# Altium schematic sheet 2SiPM_2.SchDoc
size A4
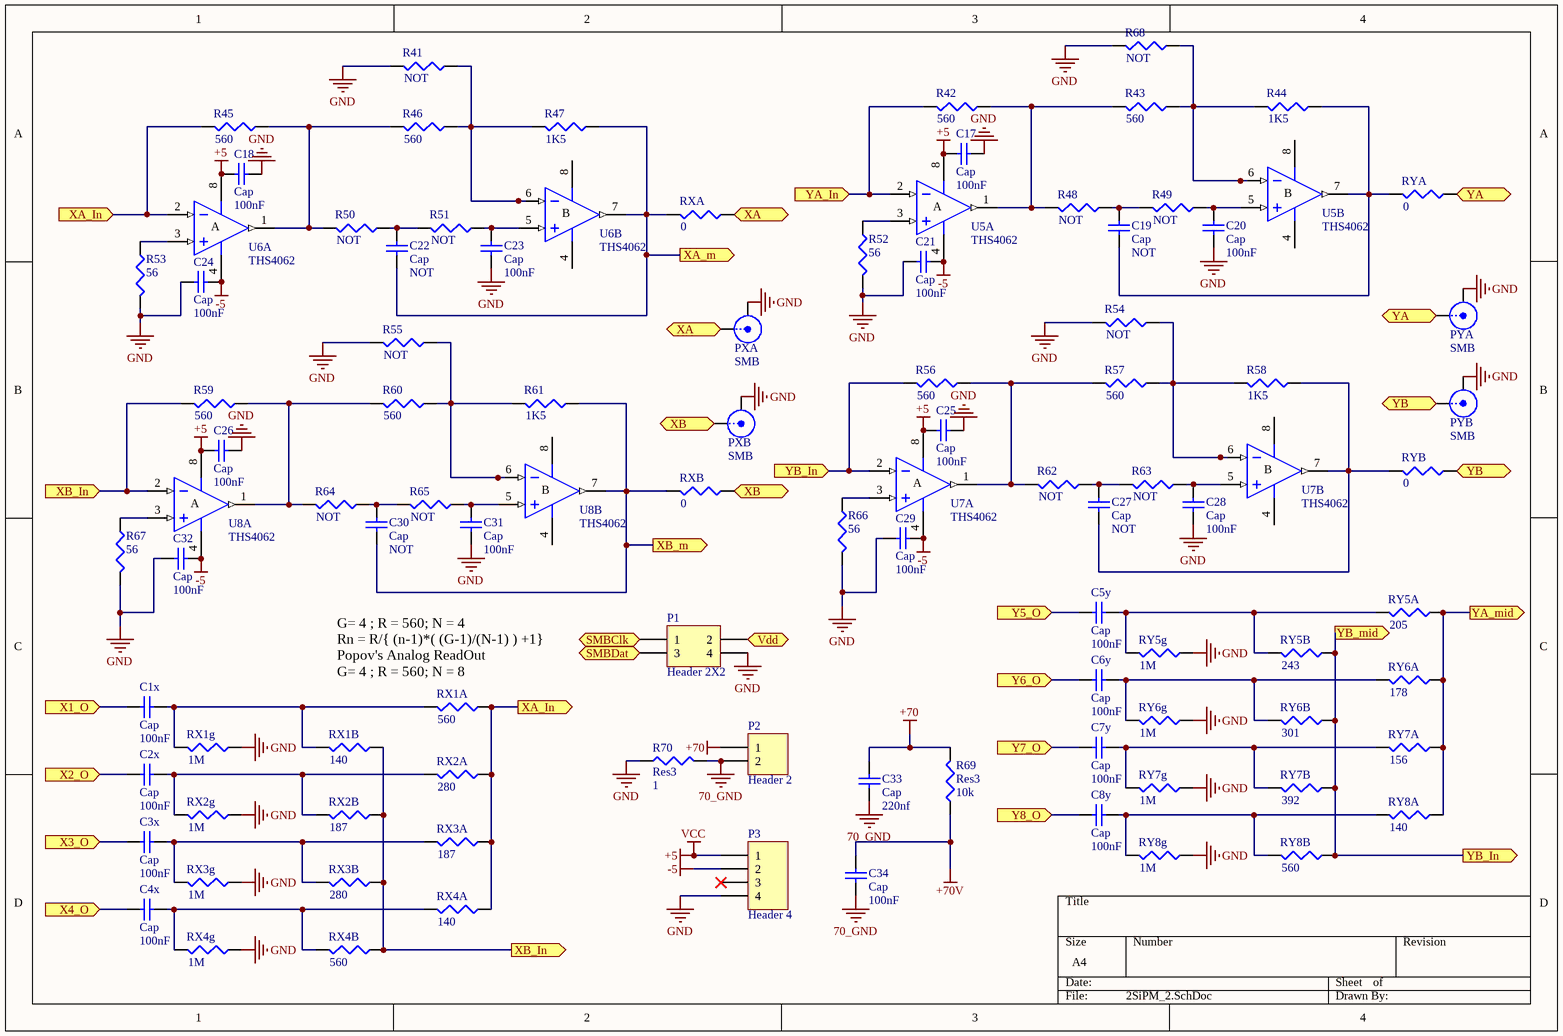
[diagram p0: 2SiPM_2.SchDoc]

## Parts
C1x  Cap  value 100nF  [1608[0603]]
C2x  Cap  value 100nF  [1608[0603]]
C3x  Cap  value 100nF  [1608[0603]]
C4x  Cap  value 100nF  [1608[0603]]
C5y  Cap  value 100nF  [1608[0603]]
C6y  Cap  value 100nF  [1608[0603]]
C7y  Cap  value 100nF  [1608[0603]]
C8y  Cap  value 100nF  [1608[0603]]
C17  Cap  value 100nF  [1608[0603]]
C18  Cap  value 100nF  [1608[0603]]
C19  Cap  value NOT  [1608[0603]]
C20  Cap  value 100nF  [1608[0603]]
C21  Cap  value 100nF  [1608[0603]]
C22  Cap  value NOT  [1608[0603]]
C23  Cap  value 100nF  [1608[0603]]
C24  Cap  value 100nF  [1608[0603]]
C25  Cap  value 100nF  [1608[0603]]
C26  Cap  value 100nF  [1608[0603]]
C27  Cap  value NOT  [1608[0603]]
C28  Cap  value 100nF  [1608[0603]]
C29  Cap  value 100nF  [1608[0603]]
C30  Cap  value NOT  [1608[0603]]
C31  Cap  value 100nF  [1608[0603]]
C32  Cap  value 100nF  [1608[0603]]
C33  Cap  value 220nf  [6-0805_N]
C34  Cap  value 100nF  [6-0805_N]
P1  Header 2X2  [HDR2X2]
P2  Header 2  [HDR1X2]
P3  Header 4  [HDR1X4]
PXA  SMB  [SMB_V-RJ45]
PXB  SMB  [SMB_V-RJ45]
PYA  SMB  [SMB_V-RJ45]
PYB  SMB  [SMB_V-RJ45]
R41  value NOT  [J1-0603]  (hidden comment: Res3)
R42  value 560  [J1-0603]  (hidden comment: Res3)
R43  value 560  [J1-0603]  (hidden comment: Res3)
R44  value 1K5  [J1-0603]  (hidden comment: Res3)
R45  value 560  [J1-0603]  (hidden comment: Res3)
R46  value 560  [J1-0603]  (hidden comment: Res3)
R47  value 1K5  [J1-0603]  (hidden comment: Res3)
R48  value NOT  [J1-0603]  (hidden comment: Res3)
R49  value NOT  [J1-0603]  (hidden comment: Res3)
R50  value NOT  [J1-0603]  (hidden comment: Res3)
R51  value NOT  [J1-0603]  (hidden comment: Res3)
R52  value 56  [J1-0603]  (hidden comment: Res3)
R53  value 56  [J1-0603]  (hidden comment: Res3)
R54  value NOT  [J1-0603]  (hidden comment: Res3)
R55  value NOT  [J1-0603]  (hidden comment: Res3)
R56  value 560  [J1-0603]  (hidden comment: Res3)
R57  value 560  [J1-0603]  (hidden comment: Res3)
R58  value 1K5  [J1-0603]  (hidden comment: Res3)
R59  value 560  [J1-0603]  (hidden comment: Res3)
R60  value 560  [J1-0603]  (hidden comment: Res3)
R61  value 1K5  [J1-0603]  (hidden comment: Res3)
R62  value NOT  [J1-0603]  (hidden comment: Res3)
R63  value NOT  [J1-0603]  (hidden comment: Res3)
R64  value NOT  [J1-0603]  (hidden comment: Res3)
R65  value NOT  [J1-0603]  (hidden comment: Res3)
R66  value 56  [J1-0603]  (hidden comment: Res3)
R67  value 56  [J1-0603]  (hidden comment: Res3)
R68  value NOT  [J1-0603]  (hidden comment: Res3)
R69  Res3  value 10k  [6-0805_N]
R70  Res3  value 1  [6-0805_N]
RX1A  value 560  [J1-0603]  (hidden comment: Res3)
RX1B  value 140  [J1-0603]  (hidden comment: Res3)
RX1g  value 1M  [J1-0603]  (hidden comment: Res3)
RX2A  value 280  [J1-0603]  (hidden comment: Res3)
RX2B  value 187  [J1-0603]  (hidden comment: Res3)
RX2g  value 1M  [J1-0603]  (hidden comment: Res3)
RX3A  value 187  [J1-0603]  (hidden comment: Res3)
RX3B  value 280  [J1-0603]  (hidden comment: Res3)
RX3g  value 1M  [J1-0603]  (hidden comment: Res3)
RX4A  value 140  [J1-0603]  (hidden comment: Res3)
RX4B  value 560  [J1-0603]  (hidden comment: Res3)
RX4g  value 1M  [J1-0603]  (hidden comment: Res3)
RXA  value 0  [J1-0603]  (hidden comment: Res3)
RXB  value 0  [J1-0603]  (hidden comment: Res3)
RY5A  value 205  [J1-0603]  (hidden comment: Res3)
RY5B  value 243  [J1-0603]  (hidden comment: Res3)
RY5g  value 1M  [J1-0603]  (hidden comment: Res3)
RY6A  value 178  [J1-0603]  (hidden comment: Res3)
RY6B  value 301  [J1-0603]  (hidden comment: Res3)
RY6g  value 1M  [J1-0603]  (hidden comment: Res3)
RY7A  value 156  [J1-0603]  (hidden comment: Res3)
RY7B  value 392  [J1-0603]  (hidden comment: Res3)
RY7g  value 1M  [J1-0603]  (hidden comment: Res3)
RY8A  value 140  [J1-0603]  (hidden comment: Res3)
RY8B  value 560  [J1-0603]  (hidden comment: Res3)
RY8g  value 1M  [J1-0603]  (hidden comment: Res3)
RYA  value 0  [J1-0603]  (hidden comment: Res3)
RYB  value 0  [J1-0603]  (hidden comment: Res3)
U5  THS4062  [SO8_M]  (parts A,B of 2)
U6  THS4062  [SO8_M]  (parts A,B of 2)
U7  THS4062  [SO8_M]  (parts A,B of 2)
U8  THS4062  [SO8_M]  (parts A,B of 2)

## Ports
SMBClk (out), SMBDat (out), Vdd (out), X1_O (in), X2_O (in), X3_O (in), X4_O (in), XA (out), XA_In (in), XA_In (out), XA_m (out), XB (out), XB_In (in), XB_In (out), XB_m (out), Y5_O (in), Y6_O (in), Y7_O (in), Y8_O (in), YA (out), YA_In (in), YA_mid (out), YB (out), YB_In (in), YB_In (out), YB_mid (out)

## Nets
70_GND: C33.1 C34.1 P2.2 R70.2
+5: C17.1 C18.1 C25.1 C26.1 P3.1 U5.8(V+) U6.8(V+) U7.8(V+) U8.8(V+)  [also labelled VCC]
+70: C33.2 P2.1 R69.2
+70V: C34.2 R69.1
-5: C21.2 C24.2 C29.2 C32.2 P3.2 U5.4(V-) U6.4(V-) U7.4(V-) U8.4(V-)
GND: C17.2 C18.2 C20.2 C21.1 C23.2 C24.1 C25.2 C26.2 C28.2 C29.1 C31.2 C32.1 P1.4 P3.4 PXA.2(Y) PXB.2(Y) PYA.2(Y) PYB.2(Y) R41.2 R52.2 R53.2 R54.2 R55.2 R66.2 R67.2 R68.2 R70.1 RX1g.1 RX2g.1 RX3g.1 RX4g.1 RY5g.1 RY6g.1 RY7g.1 RY8g.1
SMBClk: P1.1 ; port SMBClk
SMBDat: P1.3 ; port SMBDat
Vdd: P1.2 ; port Vdd
X1_O: C1x.1 ; port X1_O
X2_O: C2x.1 ; port X2_O
X3_O: C3x.1 ; port X3_O
X4_O: C4x.1 ; port X4_O
XA: PXA.1(X) RXA.1 ; port XA
XA_In: R45.2 RX1A.1 RX2A.1 RX3A.1 RX4A.1 U6.2(IN-) ; port XA_In
XA_m: C22.2 R47.1 RXA.2 U6.7(OUT) ; port XA_m
XB: PXB.1(X) RXB.1 ; port XB
XB_In: R59.2 RX1B.1 RX2B.1 RX3B.1 RX4B.1 U8.2(IN-) ; port XB_In
XB_m: C30.2 R61.1 RXB.2 U8.7(OUT) ; port XB_m
Y5_O: C5y.1 ; port Y5_O
Y6_O: C6y.1 ; port Y6_O
Y7_O: C7y.1 ; port Y7_O
Y8_O: C8y.1 ; port Y8_O
YA: PYA.1(X) RYA.1 ; port YA
YA_In: R42.2 U5.2(IN-) ; port YA_In
YA_mid: RY5A.1 RY6A.1 RY7A.1 RY8A.1 ; port YA_mid
YB: PYB.1(X) RYB.1 ; port YB
YB_In: R56.2 RY5B.1 RY6B.1 RY7B.1 RY8B.1 U7.2(IN-) ; port YB_In, port YB_mid
NetC1x_2: C1x.2 RX1A.2 RX1B.2 RX1g.2
NetC2x_2: C2x.2 RX2A.2 RX2B.2 RX2g.2
NetC3x_2: C3x.2 RX3A.2 RX3B.2 RX3g.2
NetC4x_2: C4x.2 RX4A.2 RX4B.2 RX4g.2
NetC5y_2: C5y.2 RY5A.2 RY5B.2 RY5g.2
NetC6y_2: C6y.2 RY6A.2 RY6B.2 RY6g.2
NetC7y_2: C7y.2 RY7A.2 RY7B.2 RY7g.2
NetC8y_2: C8y.2 RY8A.2 RY8B.2 RY8g.2
NetC19_1: C19.1 R48.1 R49.2
NetC19_2: C19.2 R44.1 RYA.2 U5.7(OUT)
NetC20_1: C20.1 R49.1 U5.5(IN+)
NetC22_1: C22.1 R50.1 R51.2
NetC23_1: C23.1 R51.1 U6.5(IN+)
NetC27_1: C27.1 R62.1 R63.2
NetC27_2: C27.2 R58.1 RYB.2 U7.7(OUT)
NetC28_1: C28.1 R63.1 U7.5(IN+)
NetC30_1: C30.1 R64.1 R65.2
NetC31_1: C31.1 R65.1 U8.5(IN+)
NetR41_1: R41.1 R46.1 R47.2 U6.6(IN-)
NetR42_1: R42.1 R43.2 R48.2 U5.1(OUT)
NetR43_1: R43.1 R44.2 R68.1 U5.6(IN-)
NetR45_1: R45.1 R46.2 R50.2 U6.1(OUT)
NetR52_1: R52.1 U5.3(IN+)
NetR53_1: R53.1 U6.3(IN+)
NetR54_1: R54.1 R57.1 R58.2 U7.6(IN-)
NetR55_1: R55.1 R60.1 R61.2 U8.6(IN-)
NetR56_1: R56.1 R57.2 R62.2 U7.1(OUT)
NetR59_1: R59.1 R60.2 R64.2 U8.1(OUT)
NetR66_1: R66.1 U7.3(IN+)
NetR67_1: R67.1 U8.3(IN+)

Not connected (* = marked no-connect by the designer): P3 3*

## Notes on the sheet
- (near RX1A) G= 4 ; R = 560; N = 4
  Rn = R/{ (n-1)*( (G-1)/(N-1) ) +1}
  Popov's Analog ReadOut
  G= 4 ; R = 560; N = 8
- (in symbol AD8056ARM, part A) A
- (in symbol AD8056ARM, part B) B

## Library data of the parts
C1x C2x C3x C4x C5y C6y C7y C8y C17-C34 = Cap: Capacitor; Published: 8-Jun-2000; LatestRevisionDate: 17-Jul-2002; LatestRevisionNote: Re-released for DXP Platform.; PackageReference: RAD-0.3; Publisher: Altium Limited; PackageDescription: Radial Cap, Thru-Hole; 2 Leads; 0.3 in Pin Spacing
P1 = Header 2X2: Header, 2-Pin, Dual row; LatestRevisionDate: 17-Jul-2002; LatestRevisionNote: Re-released for DXP Platform.; Publisher: Altium Limited
P2 = Header 2: Header, 2-Pin; LatestRevisionDate: 17-Jul-2002; LatestRevisionNote: Re-released for DXP Platform.; Publisher: Altium Limited
P3 = Header 4: Header, 4-Pin; LatestRevisionDate: 17-Jul-2002; LatestRevisionNote: Re-released for DXP Platform.; Publisher: Altium Limited
PXA PXB PYA PYB = SMB: SMB Straight Connector; LatestRevisionDate: 17-Jul-2002; LatestRevisionNote: Re-released for DXP Platform.; Publisher: Altium Limited
R41-R70 RX1A RX1B RX1g RX2A RX2B RX2g RX3A RX3B RX3g RX4A RX4B RX4g RXA RXB RY5A RY5B RY5g RY6A RY6B RY6g RY7A RY7B RY7g RY8A RY8B RY8g RYA RYB = Res3: Resistor; Published: 8-Jun-2000; LatestRevisionDate: 29-May-2009; LatestRevisionNote: IPC-7351 Footprint Added.; PackageReference: J1-0603; Publisher: Altium Limited; PackageDescription: Chip Resistor
U5-U8 = AD8056ARM: Low Cost, 300MHz Voltage Feedback Amplifier; Published: 8-Jun-2000; LatestRevisionDate: 04-Mar-2005; LatestRevisionNote: Stylized 3D Model Added, PCB footprint pad width decreased.; DatasheetVersion: REV. 0 1997; PackageVersion: 2004; PackageReference: RM-8; Publisher: Altium Limited; PackageDescription: Shrink Small Outline, MSOP; 8 Leads; Body Width 3 mm; Pitch 0.65 mm; Code_JEDEC: MO-187-AA; ComponentLink1Description: Manufacturer Link; ComponentLink1URL: http://www.analog.com/en/prod/0,,759_786_AD8055%2C00.html; ComponentLink2Description: Datasheet; ComponentLink2URL: http://www.analog.com/UploadedFiles/Data_Sheets/40402558757264AD8055_6_i.pdf